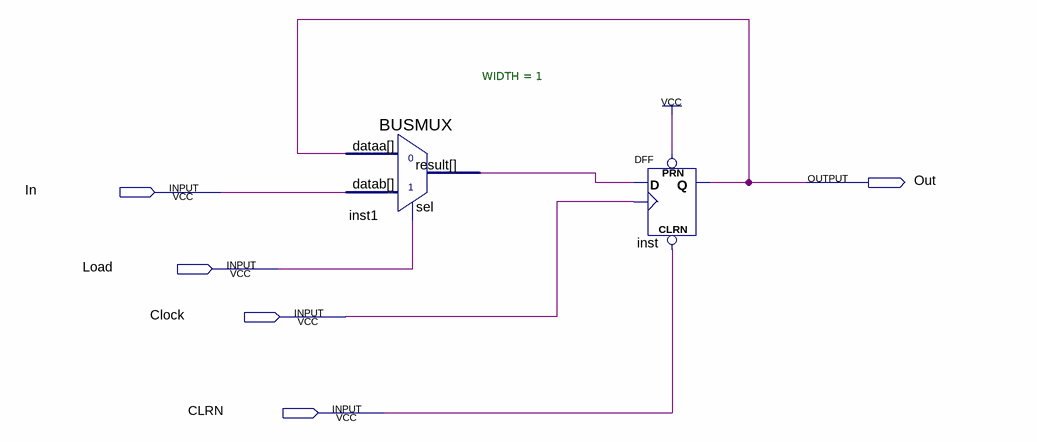
[diagram p0: schematic sheet]
// Quartus schematic register.bdf as structural Verilog: 2 symbols, 5 pins
module register (
  input  In,
  input  Load,
  input  Clock,
  input  CLRN,
  output Out
);

  wire inst1_result;

  BUSMUX #(.WIDTH(1)) inst1 (.datab(In), .sel(Load), .dataa(Out), .result(inst1_result));
  DFF inst (.CLRN(CLRN), .CLK(Clock), .D(inst1_result), .PRN(1'b1), .Q(Out));
endmodule
